# Altium project PCB_Project.PrjPcb
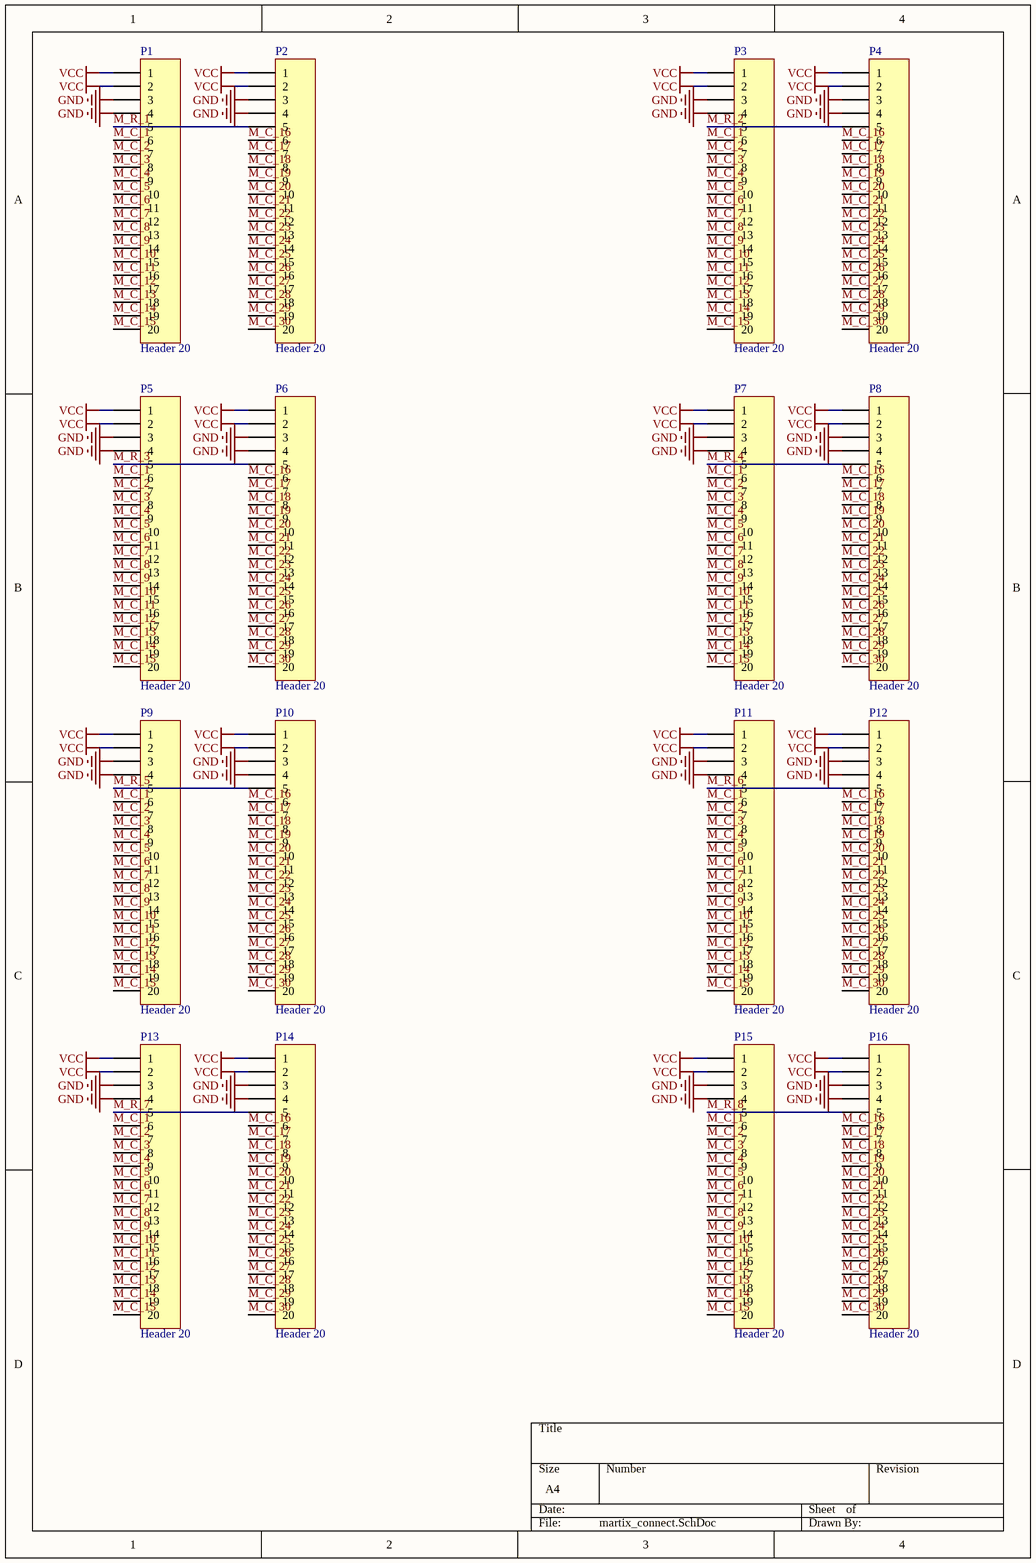
[diagram p0: martix_connect.SchDoc]
2 sheets, 32 parts. Net scope: global (net labels, ports and power ports of the same name join across sheets).
Board file: matrix_connect.PcbDoc
Sheets:
  martix_connect.SchDoc
  martix_connect_2.SchDoc

## Sheet martix_connect.SchDoc
size A4 portrait

### Parts
P1  Header 20  [FPC0.5 2H-WS-20P]
P2  Header 20  [FPC0.5 2H-WS-20P]
P3  Header 20  [FPC0.5 2H-WS-20P]
P4  Header 20  [FPC0.5 2H-WS-20P]
P5  Header 20  [FPC0.5 2H-WS-20P]
P6  Header 20  [FPC0.5 2H-WS-20P]
P7  Header 20  [FPC0.5 2H-WS-20P]
P8  Header 20  [FPC0.5 2H-WS-20P]
P9  Header 20  [FPC0.5 2H-WS-20P]
P10  Header 20  [FPC0.5 2H-WS-20P]
P11  Header 20  [FPC0.5 2H-WS-20P]
P12  Header 20  [FPC0.5 2H-WS-20P]
P13  Header 20  [FPC0.5 2H-WS-20P]
P14  Header 20  [FPC0.5 2H-WS-20P]
P15  Header 20  [FPC0.5 2H-WS-20P]
P16  Header 20  [FPC0.5 2H-WS-20P]

### Nets
GND: P1.3 P1.4 P2.3 P2.4 P3.3 P3.4 P4.3 P4.4 P5.3 P5.4 P6.3 P6.4 P7.3 P7.4 P8.3 P8.4 P9.3 P9.4 P10.3 P10.4 P11.3 P11.4 P12.3 P12.4 P13.3 P13.4 P14.3 P14.4 P15.3 P15.4 P16.3 P16.4
VCC: P1.1 P1.2 P2.1 P2.2 P3.1 P3.2 P4.1 P4.2 P5.1 P5.2 P6.1 P6.2 P7.1 P7.2 P8.1 P8.2 P9.1 P9.2 P10.1 P10.2 P11.1 P11.2 P12.1 P12.2 P13.1 P13.2 P14.1 P14.2 P15.1 P15.2 P16.1 P16.2
M_C_1: P1.6 P3.6 P5.6 P7.6 P9.6 P11.6 P13.6 P15.6
M_C_2: P1.7 P3.7 P5.7 P7.7 P9.7 P11.7 P13.7 P15.7
M_C_3: P1.8 P3.8 P5.8 P7.8 P9.8 P11.8 P13.8 P15.8
M_C_4: P1.9 P3.9 P5.9 P7.9 P9.9 P11.9 P13.9 P15.9
M_C_5: P1.10 P3.10 P5.10 P7.10 P9.10 P11.10 P13.10 P15.10
M_C_6: P1.11 P3.11 P5.11 P7.11 P9.11 P11.11 P13.11 P15.11
M_C_7: P1.12 P3.12 P5.12 P7.12 P9.12 P11.12 P13.12 P15.12
M_C_8: P1.13 P3.13 P5.13 P7.13 P9.13 P11.13 P13.13 P15.13
M_C_9: P1.14 P3.14 P5.14 P7.14 P9.14 P11.14 P13.14 P15.14
M_C_10: P1.15 P3.15 P5.15 P7.15 P9.15 P11.15 P13.15 P15.15
M_C_11: P1.16 P3.16 P5.16 P7.16 P9.16 P11.16 P13.16 P15.16
M_C_12: P1.17 P3.17 P5.17 P7.17 P9.17 P11.17 P13.17 P15.17
M_C_13: P1.18 P3.18 P5.18 P7.18 P9.18 P11.18 P13.18 P15.18
M_C_14: P1.19 P3.19 P5.19 P7.19 P9.19 P11.19 P13.19 P15.19
M_C_15: P1.20 P3.20 P5.20 P7.20 P9.20 P11.20 P13.20 P15.20
M_C_16: P2.6 P4.6 P6.6 P8.6 P10.6 P12.6 P14.6 P16.6
M_C_17: P2.7 P4.7 P6.7 P8.7 P10.7 P12.7 P14.7 P16.7
M_C_18: P2.8 P4.8 P6.8 P8.8 P10.8 P12.8 P14.8 P16.8
M_C_19: P2.9 P4.9 P6.9 P8.9 P10.9 P12.9 P14.9 P16.9
M_C_20: P2.10 P4.10 P6.10 P8.10 P10.10 P12.10 P14.10 P16.10
M_C_21: P2.11 P4.11 P6.11 P8.11 P10.11 P12.11 P14.11 P16.11
M_C_22: P2.12 P4.12 P6.12 P8.12 P10.12 P12.12 P14.12 P16.12
M_C_23: P2.13 P4.13 P6.13 P8.13 P10.13 P12.13 P14.13 P16.13
M_C_24: P2.14 P4.14 P6.14 P8.14 P10.14 P12.14 P14.14 P16.14
M_C_25: P2.15 P4.15 P6.15 P8.15 P10.15 P12.15 P14.15 P16.15
M_C_26: P2.16 P4.16 P6.16 P8.16 P10.16 P12.16 P14.16 P16.16
M_C_27: P2.17 P4.17 P6.17 P8.17 P10.17 P12.17 P14.17 P16.17
M_C_28: P2.18 P4.18 P6.18 P8.18 P10.18 P12.18 P14.18 P16.18
M_C_29: P2.19 P4.19 P6.19 P8.19 P10.19 P12.19 P14.19 P16.19
M_C_30: P2.20 P4.20 P6.20 P8.20 P10.20 P12.20 P14.20 P16.20
M_R_1: P1.5 P2.5
M_R_2: P3.5 P4.5
M_R_3: P5.5 P6.5
M_R_4: P7.5 P8.5
M_R_5: P9.5 P10.5
M_R_6: P11.5 P12.5
M_R_7: P13.5 P14.5
M_R_8: P15.5 P16.5

### Library data of the parts
P1-P16 = Header 20: Header, 20-Pin; LatestRevisionDate: 17-Jul-2002; LatestRevisionNote: Re-released for DXP Platform.; Publisher: Altium Limited

## Sheet martix_connect_2.SchDoc
size A4 portrait
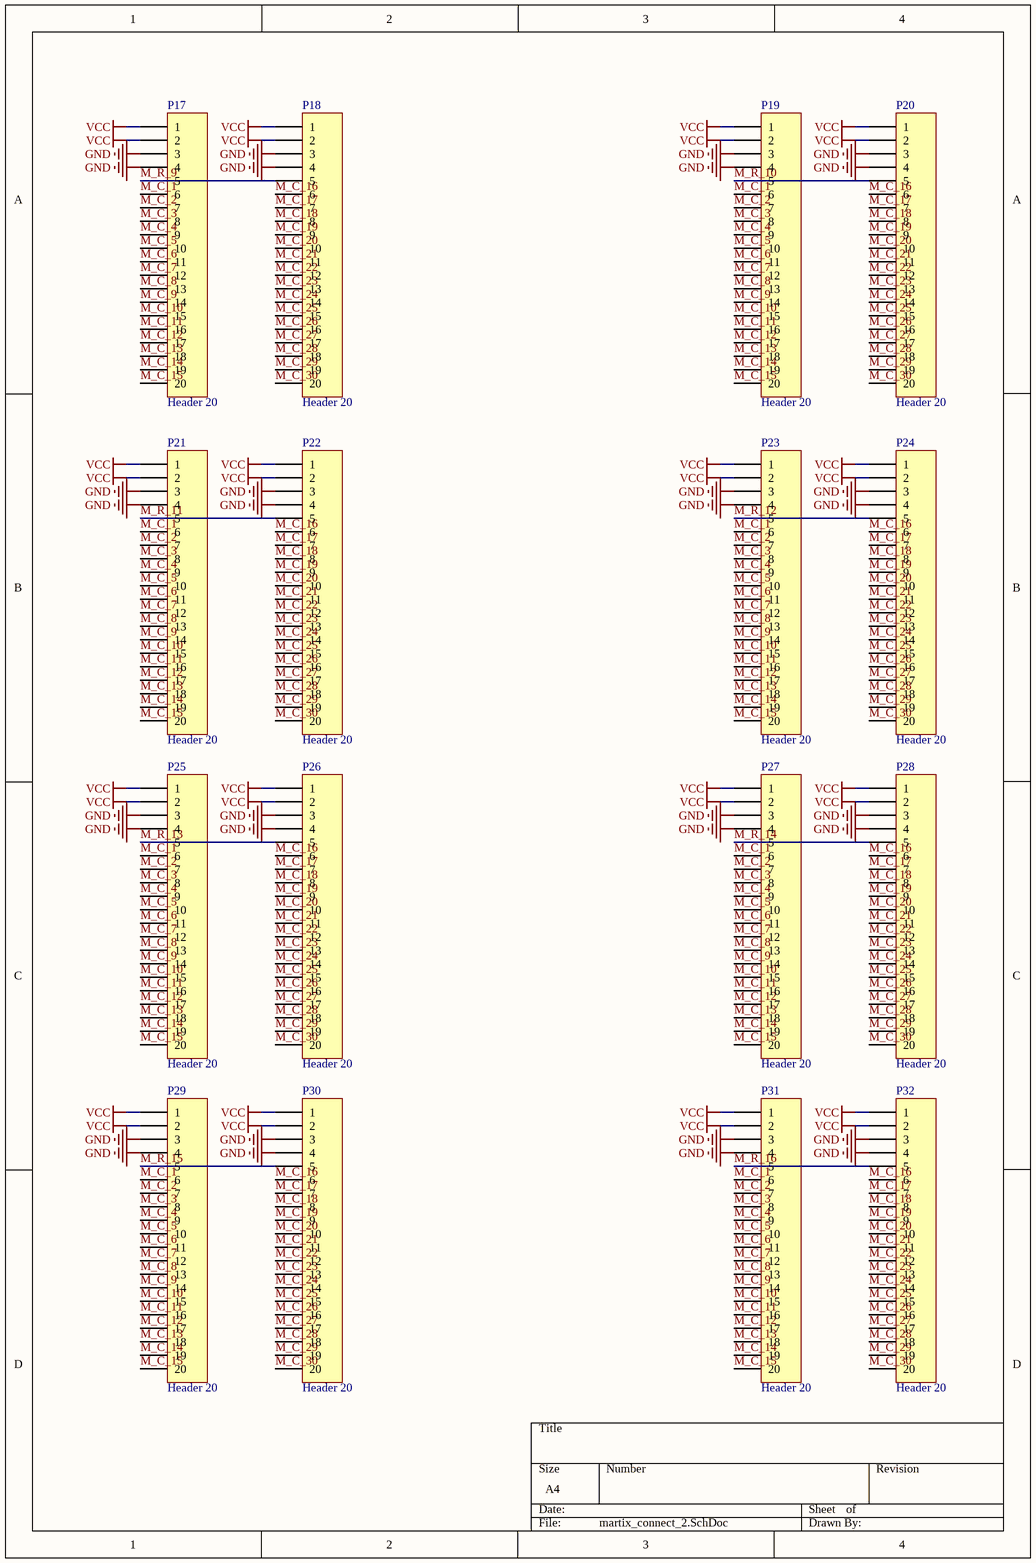
[diagram p1: martix_connect_2.SchDoc]

### Parts
P17  Header 20  [FPC0.5 2H-WS-20P]
P18  Header 20  [FPC0.5 2H-WS-20P]
P19  Header 20  [FPC0.5 2H-WS-20P]
P20  Header 20  [FPC0.5 2H-WS-20P]
P21  Header 20  [FPC0.5 2H-WS-20P]
P22  Header 20  [FPC0.5 2H-WS-20P]
P23  Header 20  [FPC0.5 2H-WS-20P]
P24  Header 20  [FPC0.5 2H-WS-20P]
P25  Header 20  [FPC0.5 2H-WS-20P]
P26  Header 20  [FPC0.5 2H-WS-20P]
P27  Header 20  [FPC0.5 2H-WS-20P]
P28  Header 20  [FPC0.5 2H-WS-20P]
P29  Header 20  [FPC0.5 2H-WS-20P]
P30  Header 20  [FPC0.5 2H-WS-20P]
P31  Header 20  [FPC0.5 2H-WS-20P]
P32  Header 20  [FPC0.5 2H-WS-20P]

### Nets
GND: P17.3 P17.4 P18.3 P18.4 P19.3 P19.4 P20.3 P20.4 P21.3 P21.4 P22.3 P22.4 P23.3 P23.4 P24.3 P24.4 P25.3 P25.4 P26.3 P26.4 P27.3 P27.4 P28.3 P28.4 P29.3 P29.4 P30.3 P30.4 P31.3 P31.4 P32.3 P32.4
VCC: P17.1 P17.2 P18.1 P18.2 P19.1 P19.2 P20.1 P20.2 P21.1 P21.2 P22.1 P22.2 P23.1 P23.2 P24.1 P24.2 P25.1 P25.2 P26.1 P26.2 P27.1 P27.2 P28.1 P28.2 P29.1 P29.2 P30.1 P30.2 P31.1 P31.2 P32.1 P32.2
M_C_1: P17.6 P19.6 P21.6 P23.6 P25.6 P27.6 P29.6 P31.6
M_C_2: P17.7 P19.7 P21.7 P23.7 P25.7 P27.7 P29.7 P31.7
M_C_3: P17.8 P19.8 P21.8 P23.8 P25.8 P27.8 P29.8 P31.8
M_C_4: P17.9 P19.9 P21.9 P23.9 P25.9 P27.9 P29.9 P31.9
M_C_5: P17.10 P19.10 P21.10 P23.10 P25.10 P27.10 P29.10 P31.10
M_C_6: P17.11 P19.11 P21.11 P23.11 P25.11 P27.11 P29.11 P31.11
M_C_7: P17.12 P19.12 P21.12 P23.12 P25.12 P27.12 P29.12 P31.12
M_C_8: P17.13 P19.13 P21.13 P23.13 P25.13 P27.13 P29.13 P31.13
M_C_9: P17.14 P19.14 P21.14 P23.14 P25.14 P27.14 P29.14 P31.14
M_C_10: P17.15 P19.15 P21.15 P23.15 P25.15 P27.15 P29.15 P31.15
M_C_11: P17.16 P19.16 P21.16 P23.16 P25.16 P27.16 P29.16 P31.16
M_C_12: P17.17 P19.17 P21.17 P23.17 P25.17 P27.17 P29.17 P31.17
M_C_13: P17.18 P19.18 P21.18 P23.18 P25.18 P27.18 P29.18 P31.18
M_C_14: P17.19 P19.19 P21.19 P23.19 P25.19 P27.19 P29.19 P31.19
M_C_15: P17.20 P19.20 P21.20 P23.20 P25.20 P27.20 P29.20 P31.20
M_C_16: P18.6 P20.6 P22.6 P24.6 P26.6 P28.6 P30.6 P32.6
M_C_17: P18.7 P20.7 P22.7 P24.7 P26.7 P28.7 P30.7 P32.7
M_C_18: P18.8 P20.8 P22.8 P24.8 P26.8 P28.8 P30.8 P32.8
M_C_19: P18.9 P20.9 P22.9 P24.9 P26.9 P28.9 P30.9 P32.9
M_C_20: P18.10 P20.10 P22.10 P24.10 P26.10 P28.10 P30.10 P32.10
M_C_21: P18.11 P20.11 P22.11 P24.11 P26.11 P28.11 P30.11 P32.11
M_C_22: P18.12 P20.12 P22.12 P24.12 P26.12 P28.12 P30.12 P32.12
M_C_23: P18.13 P20.13 P22.13 P24.13 P26.13 P28.13 P30.13 P32.13
M_C_24: P18.14 P20.14 P22.14 P24.14 P26.14 P28.14 P30.14 P32.14
M_C_25: P18.15 P20.15 P22.15 P24.15 P26.15 P28.15 P30.15 P32.15
M_C_26: P18.16 P20.16 P22.16 P24.16 P26.16 P28.16 P30.16 P32.16
M_C_27: P18.17 P20.17 P22.17 P24.17 P26.17 P28.17 P30.17 P32.17
M_C_28: P18.18 P20.18 P22.18 P24.18 P26.18 P28.18 P30.18 P32.18
M_C_29: P18.19 P20.19 P22.19 P24.19 P26.19 P28.19 P30.19 P32.19
M_C_30: P18.20 P20.20 P22.20 P24.20 P26.20 P28.20 P30.20 P32.20
M_R_9: P17.5 P18.5
M_R_10: P19.5 P20.5
M_R_11: P21.5 P22.5
M_R_12: P23.5 P24.5
M_R_13: P25.5 P26.5
M_R_14: P27.5 P28.5
M_R_15: P29.5 P30.5
M_R_16: P31.5 P32.5

### Library data of the parts
P17-P32 = Header 20: Header, 20-Pin; LatestRevisionDate: 17-Jul-2002; LatestRevisionNote: Re-released for DXP Platform.; Publisher: Altium Limited

## Nets that join several sheets
GND: martix_connect (32 pins), martix_connect_2 (32 pins)
VCC: martix_connect (32 pins), martix_connect_2 (32 pins)
M_C_1: martix_connect (8 pins), martix_connect_2 (8 pins)
M_C_2: martix_connect (8 pins), martix_connect_2 (8 pins)
M_C_3: martix_connect (8 pins), martix_connect_2 (8 pins)
M_C_4: martix_connect (8 pins), martix_connect_2 (8 pins)
M_C_5: martix_connect (8 pins), martix_connect_2 (8 pins)
M_C_6: martix_connect (8 pins), martix_connect_2 (8 pins)
M_C_7: martix_connect (8 pins), martix_connect_2 (8 pins)
M_C_8: martix_connect (8 pins), martix_connect_2 (8 pins)
M_C_9: martix_connect (8 pins), martix_connect_2 (8 pins)
M_C_10: martix_connect (8 pins), martix_connect_2 (8 pins)
M_C_11: martix_connect (8 pins), martix_connect_2 (8 pins)
M_C_12: martix_connect (8 pins), martix_connect_2 (8 pins)
M_C_13: martix_connect (8 pins), martix_connect_2 (8 pins)
M_C_14: martix_connect (8 pins), martix_connect_2 (8 pins)
M_C_15: martix_connect (8 pins), martix_connect_2 (8 pins)
M_C_16: martix_connect (8 pins), martix_connect_2 (8 pins)
M_C_17: martix_connect (8 pins), martix_connect_2 (8 pins)
M_C_18: martix_connect (8 pins), martix_connect_2 (8 pins)
M_C_19: martix_connect (8 pins), martix_connect_2 (8 pins)
M_C_20: martix_connect (8 pins), martix_connect_2 (8 pins)
M_C_21: martix_connect (8 pins), martix_connect_2 (8 pins)
M_C_22: martix_connect (8 pins), martix_connect_2 (8 pins)
M_C_23: martix_connect (8 pins), martix_connect_2 (8 pins)
M_C_24: martix_connect (8 pins), martix_connect_2 (8 pins)
M_C_25: martix_connect (8 pins), martix_connect_2 (8 pins)
M_C_26: martix_connect (8 pins), martix_connect_2 (8 pins)
M_C_27: martix_connect (8 pins), martix_connect_2 (8 pins)
M_C_28: martix_connect (8 pins), martix_connect_2 (8 pins)
M_C_29: martix_connect (8 pins), martix_connect_2 (8 pins)
M_C_30: martix_connect (8 pins), martix_connect_2 (8 pins)